# EAGLE design calculator (EAGLE 9.6.2)
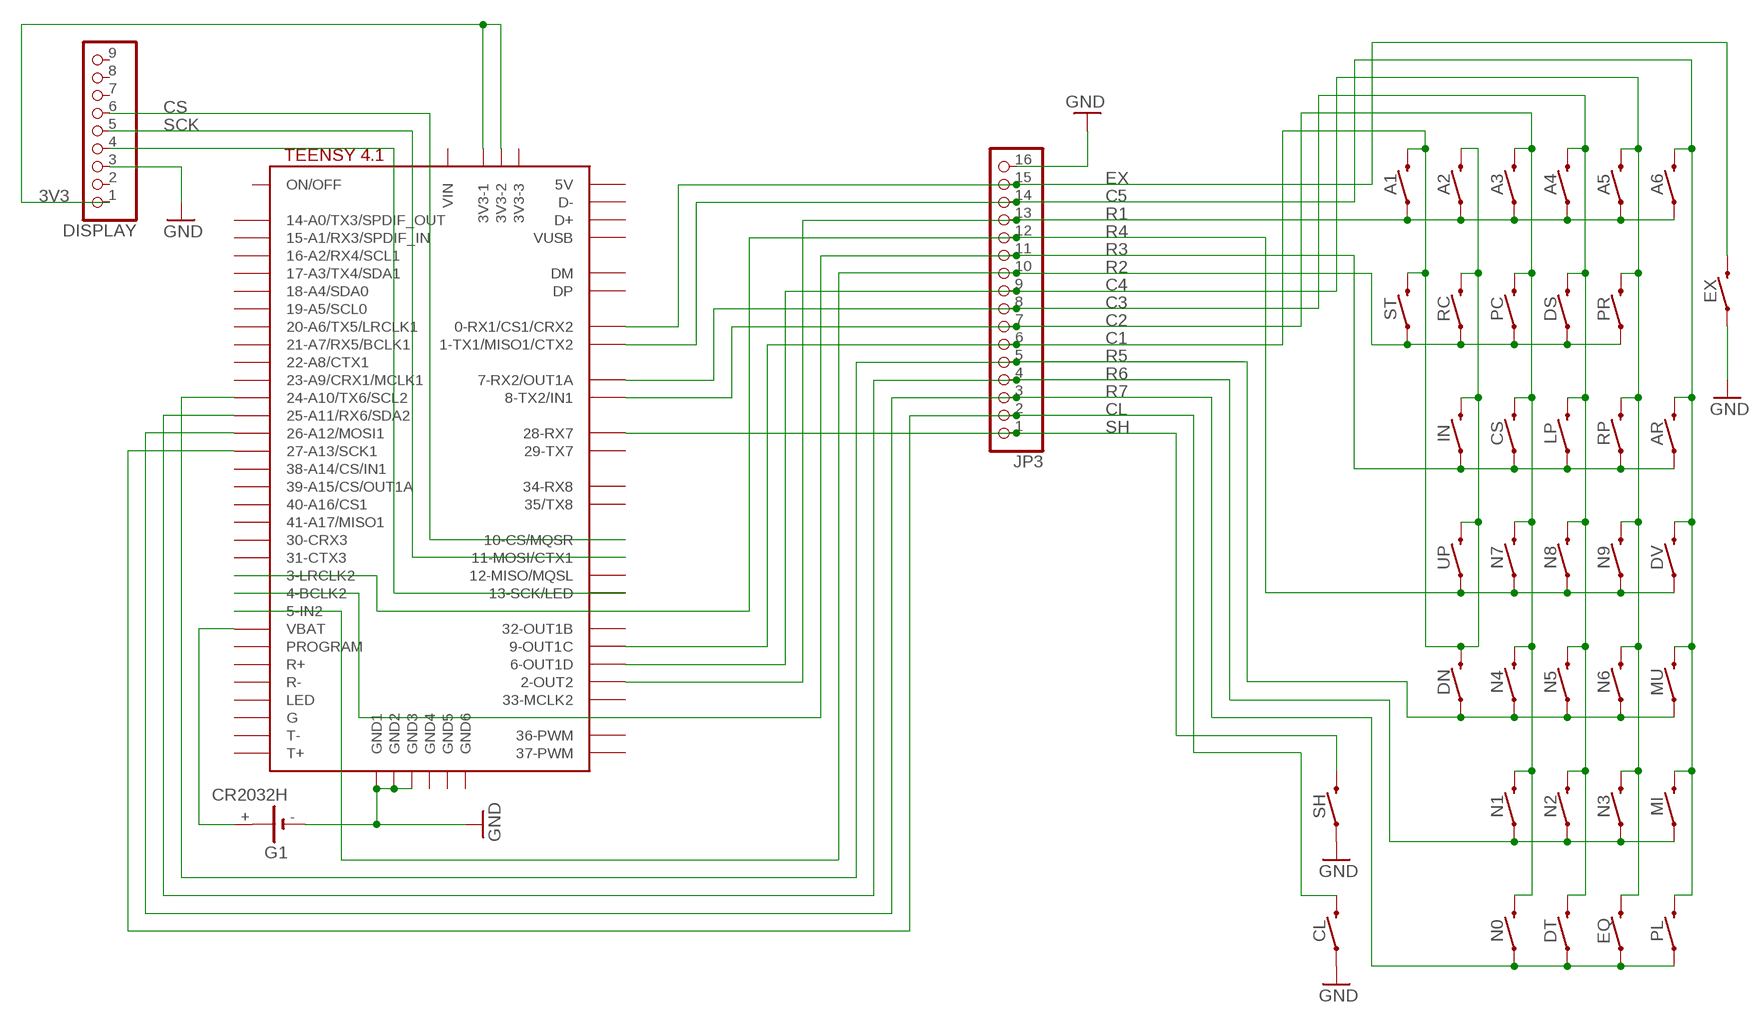
[diagram p0: schematic, sheet 1]

## Parts
A1  MOMENTARY-SWITCH-SPST-PTH-6.0MM  [TACTILE_SWITCH_PTH_6.0MM]
A2  MOMENTARY-SWITCH-SPST-PTH-6.0MM  [TACTILE_SWITCH_PTH_6.0MM]
A3  MOMENTARY-SWITCH-SPST-PTH-6.0MM  [TACTILE_SWITCH_PTH_6.0MM]
A4  MOMENTARY-SWITCH-SPST-PTH-6.0MM  [TACTILE_SWITCH_PTH_6.0MM]
A5  MOMENTARY-SWITCH-SPST-PTH-6.0MM  [TACTILE_SWITCH_PTH_6.0MM]
A6  MOMENTARY-SWITCH-SPST-PTH-6.0MM  [TACTILE_SWITCH_PTH_6.0MM]
AR  MOMENTARY-SWITCH-SPST-PTH-6.0MM  [TACTILE_SWITCH_PTH_6.0MM]
CL  MOMENTARY-SWITCH-SPST-PTH-6.0MM  [TACTILE_SWITCH_PTH_6.0MM]
CS  MOMENTARY-SWITCH-SPST-PTH-6.0MM  [TACTILE_SWITCH_PTH_6.0MM]
DISPLAY  PINHD-1X9  [1X09-BIG]
DN  MOMENTARY-SWITCH-SPST-PTH-6.0MM  [TACTILE_SWITCH_PTH_6.0MM]
DS  MOMENTARY-SWITCH-SPST-PTH-6.0MM  [TACTILE_SWITCH_PTH_6.0MM]
DT  MOMENTARY-SWITCH-SPST-PTH-6.0MM  [TACTILE_SWITCH_PTH_6.0MM]
DV  MOMENTARY-SWITCH-SPST-PTH-6.0MM  [TACTILE_SWITCH_PTH_6.0MM]
EQ  MOMENTARY-SWITCH-SPST-PTH-6.0MM  [TACTILE_SWITCH_PTH_6.0MM]
EX  MOMENTARY-SWITCH-SPST-PTH-6.0MM  [TACTILE_SWITCH_PTH_6.0MM]
G1  CR2032H  [CR2032H]
IN  MOMENTARY-SWITCH-SPST-PTH-6.0MM  [TACTILE_SWITCH_PTH_6.0MM]
JP3  PINHD-1X16  [1X16]
LP  MOMENTARY-SWITCH-SPST-PTH-6.0MM  [TACTILE_SWITCH_PTH_6.0MM]
MI  MOMENTARY-SWITCH-SPST-PTH-6.0MM  [TACTILE_SWITCH_PTH_6.0MM]
MU  MOMENTARY-SWITCH-SPST-PTH-6.0MM  [TACTILE_SWITCH_PTH_6.0MM]
N0  MOMENTARY-SWITCH-SPST-PTH-6.0MM  [TACTILE_SWITCH_PTH_6.0MM]
N1  MOMENTARY-SWITCH-SPST-PTH-6.0MM  [TACTILE_SWITCH_PTH_6.0MM]
N2  MOMENTARY-SWITCH-SPST-PTH-6.0MM  [TACTILE_SWITCH_PTH_6.0MM]
N3  MOMENTARY-SWITCH-SPST-PTH-6.0MM  [TACTILE_SWITCH_PTH_6.0MM]
N4  MOMENTARY-SWITCH-SPST-PTH-6.0MM  [TACTILE_SWITCH_PTH_6.0MM]
N5  MOMENTARY-SWITCH-SPST-PTH-6.0MM  [TACTILE_SWITCH_PTH_6.0MM]
N6  MOMENTARY-SWITCH-SPST-PTH-6.0MM  [TACTILE_SWITCH_PTH_6.0MM]
N7  MOMENTARY-SWITCH-SPST-PTH-6.0MM  [TACTILE_SWITCH_PTH_6.0MM]
N8  MOMENTARY-SWITCH-SPST-PTH-6.0MM  [TACTILE_SWITCH_PTH_6.0MM]
N9  MOMENTARY-SWITCH-SPST-PTH-6.0MM  [TACTILE_SWITCH_PTH_6.0MM]
PC  MOMENTARY-SWITCH-SPST-PTH-6.0MM  [TACTILE_SWITCH_PTH_6.0MM]
PL  MOMENTARY-SWITCH-SPST-PTH-6.0MM  [TACTILE_SWITCH_PTH_6.0MM]
PR  MOMENTARY-SWITCH-SPST-PTH-6.0MM  [TACTILE_SWITCH_PTH_6.0MM]
RC  MOMENTARY-SWITCH-SPST-PTH-6.0MM  [TACTILE_SWITCH_PTH_6.0MM]
RP  MOMENTARY-SWITCH-SPST-PTH-6.0MM  [TACTILE_SWITCH_PTH_6.0MM]
SH  MOMENTARY-SWITCH-SPST-PTH-6.0MM  [TACTILE_SWITCH_PTH_6.0MM]
ST  MOMENTARY-SWITCH-SPST-PTH-6.0MM  [TACTILE_SWITCH_PTH_6.0MM]
U$1  TEENSY41  [TEENSY41]
UP  MOMENTARY-SWITCH-SPST-PTH-6.0MM  [TACTILE_SWITCH_PTH_6.0MM]

## Nets
3V3: DISPLAY.1 U$1.3V3-1 U$1.3V3-2
C1: A1.3 A2.3 DN.3 IN.3 JP3.6 RC.3 ST.3 U$1.9-OUT1C UP.3
C2: A3.3 CS.3 JP3.7 N0.3 N1.3 N4.3 N7.3 PC.3 U$1.8-TX2/IN2(8-TX2/IN1)
C3: A4.3 DS.3 DT.3 JP3.8 LP.3 N2.3 N5.3 N8.3 U$1.7-RX2/OUT1A
C4: A5.3 EQ.3 JP3.9 N3.3 N6.3 N9.3 PR.3 RP.3 U$1.6-OUT1D
C5: A6.3 AR.3 DV.3 JP3.14 MI.3 MU.3 PL.3 U$1.1-TX1/MISO1/CTX2
CL: CL.3 JP3.2 U$1.27-A13/SCK1
CS: DISPLAY.6 U$1.10-CS\MQSR(10-CS/MQSR)
EX: EX.3 JP3.15 U$1.0-RX1/CS1/CRX2
GND: CL.1 DISPLAY.3 EX.1 G1.- JP3.16 SH.1 U$1.GND1 U$1.GND2 U$1.GND3
MOSI: DISPLAY.5 U$1.11-MOSI/CTX1
N$2: G1.+ U$1.VBAT
R1: A1.1 A2.1 A3.1 A4.1 A5.1 A6.1 JP3.13 U$1.2-OUT2
R2: DS.1 JP3.10 PC.1 PR.1 RC.1 ST.1 U$1.5-IN2
R3: AR.1 CS.1 IN.1 JP3.11 LP.1 RP.1 U$1.4-BCLK2
R4: DV.1 JP3.12 N7.1 N8.1 N9.1 U$1.3-LRCLK2 UP.1
R5: DN.1 JP3.5 MU.1 N4.1 N5.1 N6.1 U$1.24-A10/TX6/SCL2
R6: JP3.4 MI.1 N1.1 N2.1 N3.1 U$1.25-A11/RX6/SDA2
R7: DT.1 EQ.1 JP3.3 N0.1 PL.1 U$1.26-A12/MOSI1
SCK: DISPLAY.4 U$1.13-SCK/LED
SH: JP3.1 SH.3 U$1.28-RX7
Unconnected: DISPLAY.2 DISPLAY.7 DISPLAY.8 DISPLAY.9 G1.+@1(+) U$1.3V3-3 U$1.12-MISO/MQSL U$1.14-A0/TX3/SPDIF_OUT U$1.15-A1/RX3/SPDIF_IN U$1.16-A2/RX4/SCL1 U$1.17-A3/TX4/SDA1 U$1.18-A4/SDA0 U$1.19-A5/SCL0 U$1.20-A6/TX5/LRCLK1 U$1.21-A7/RX5/BCLK1 U$1.22-A8/CTX1 U$1.23-A9/CRX1/MCLK1 U$1.29-TX7 U$1.30-CRX3 U$1.31-CTX3 U$1.32-OUT1B U$1.33-MCLK2 U$1.34-RX8 U$1.35-TX8(35/TX8) U$1.36-PWM U$1.37-PWM U$1.38-A14/CS/IN1 U$1.39-A15/CS/OUT1A U$1.40-A16/CS1 U$1.41-A17/MISO1 U$1.+5V(5V) U$1.D+ U$1.D- U$1.DM U$1.DP U$1.G U$1.GND4 U$1.GND5 U$1.GND6 U$1.LED U$1.ON/OFF U$1.PROGRAM U$1.R+ U$1.R- U$1.T+ U$1.T- U$1.VIN U$1.VUSB

## Library data of the parts
A1-A6 AR CL CS DN DS DT DV EQ EX IN LP MI MU N0 N1-N9 PC PL PR RC RP SH ST UP = SparkFun-Switches:MOMENTARY-SWITCH-SPST: Momentary Switch (Pushbutton) - SPST Normally-open (NO) SPST momentary switches (buttons, pushbuttons). Variants PTH-12MM - 12mm square, through-hole Momentary Pushbutton Switch - 12mm Square <https://www.sparkfun.com/products/9190> (COM-09190) PTH-6.0MM, PTH-6.0MM-KIT - 6.0mm square, through-hole Mini Pushbutton Switch <https://www.sparkfun.com/products/97> (COM-00097) KIT package intended for soldering kit's - only one side of pads' copper is exposed. PTH-RIGHT-ANGLE-KIT - Right-angle, through-hole Right Angle Tactile Button <https://www.sparkfun.com/products/10791> - Used on SparkFun BigTime Watch Kit <https://www.sparkfun.com/products/11734> SMD-12MM - 12mm square, surface-mount Tactile Button - SMD (12mm) <https://www.sparkfun.com/products/12993> (COM-12993) Used on SparkFun PicoBoard <https://www.sparkfun.com/products/11888> SMD-4.5MM - 4.5mm Square Trackball Switch Used on SparkFun Blackberry Trackballer Breakout <https://www.sparkfun.com/products/13169> SMD-4.6MMX2.8MM - 4.60mm x 2.80mm, surface mount Used on SparkFun SAMD21 Mini Breakout <https://www.sparkfun.com/products/13664> SMD-5.2MM, SMD-5.2-REDUNDANT - 5.2mm square, surface-mount Mini Pushbutton Switch - SMD <https://www.sparkfun.com/products/8720> (COM-08720) Used on Arduino Pro Mini <https://www.sparkfun.com/products/11114> REDUNDANT package connects both switch circuits together SMD-6.0X3.5MM - 6.0 x 3.5mm, surface mount Momentary Reset Switch SMD <https://www.sparkfun.com/products/8229> (COM-08229) SMD-6.2MM-TALL - 6.2mm square, surface mount Tactile Button - SMD (6mm) <https://www.sparkfun.com/products/12992> Used on SparkFun Digital Sandbox <https://www.sparkfun.com/products/12651> SMD-RIGHT-ANGLE - Right-angle, surface mount Used on SparkFun Block for Intel® Edison - Arduino <https://www.sparkfun.com/products/13036>; PROD_ID: SWCH-08441; SF_SKU: COM-00097
DISPLAY = adafruit:PINHD-1X9: Pin header 1x10 0.1" spacing With round pins
G1 = battery:CR2032H: LI BATTERY Varta
JP3 = pinhead:PINHD-1X16: PIN HEADER
U$1 = teensy:TEENSY41

## Board
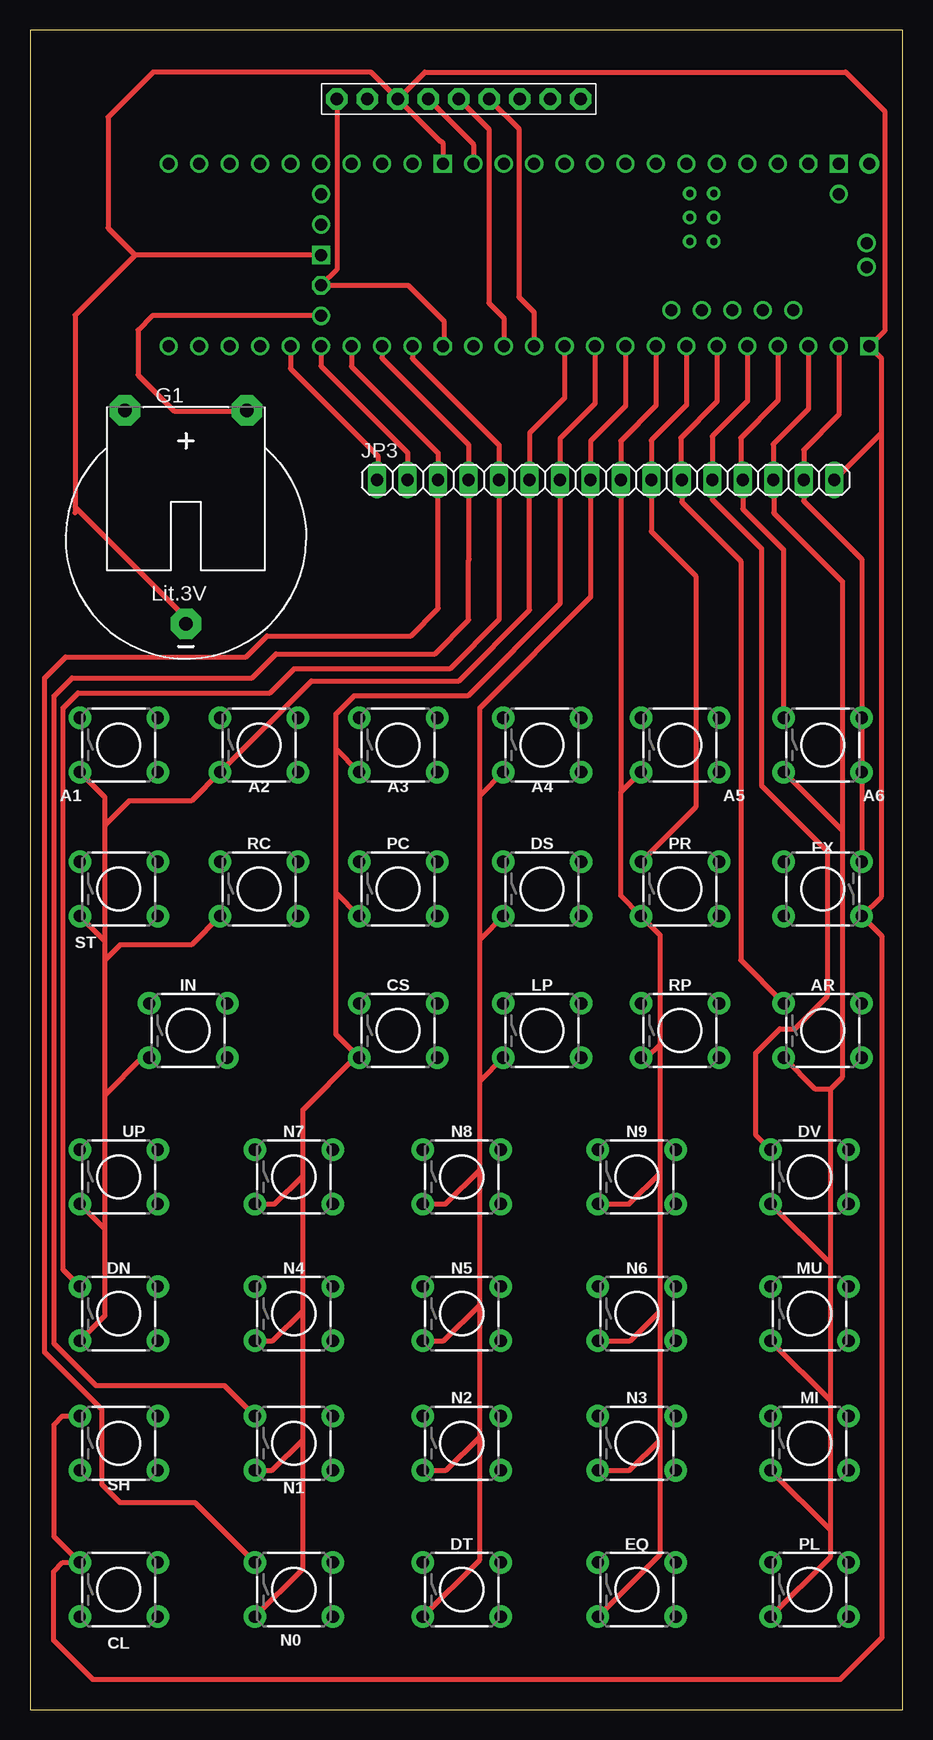
[diagram p1: board, top side]
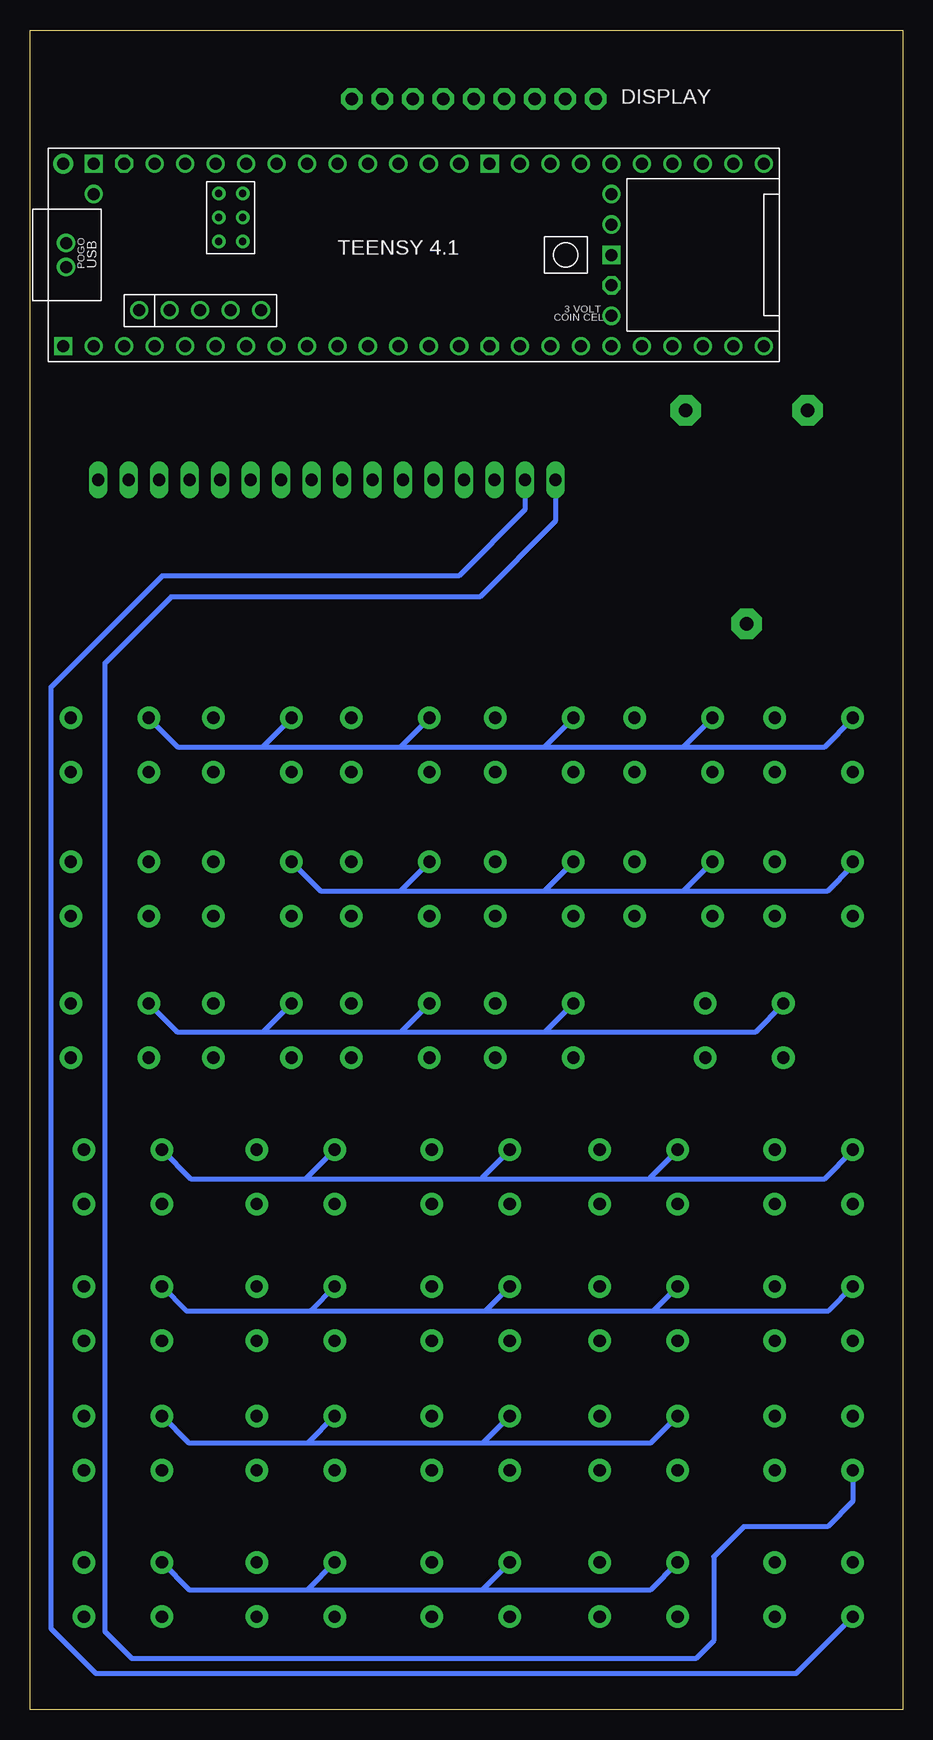
[diagram p2: board, bottom side, seen from below]

Size 72.75 x 140 mm. Coordinates in mm from the lower left corner, seen from the top.
Outline: 0,0 72.75,0 72.75,140 0,140 0,0
Copper layers (1*16): Top 0.035mm / dielectric 1.5mm / Bottom 0.035mm
Design rules "default": minimum track width 6mil, minimum drill 0.35mm, track to track 6mil, track to pad 6mil, pad to pad 6mil, via to via 6mil, smd to smd 6mil, copper to edge 40mil, drill to drill 6mil, minimum pad ring 10mil, minimum via ring 8mil, stop-mask expansion 4mil, vias tented up to drill 0mil, thermal gap 10mil

### Footprints (pad centres in the part's own frame; a part is rotated, then mirrored left to right if it is on the bottom)
TACTILE_SWITCH_PTH_6.0MM = drill 1.016 pad 1.88: 1 -3.251,2.261; 2 3.251,2.261; 3 -3.251,-2.261; 4 3.251,-2.261
1X09-BIG = drill 1.016 pad 1.778 octagon: 1 -10.16,0; 2 -7.62,0; 3 -5.08,0; 4 -2.54,0; 5 0,0; 6 2.54,0; 7 5.08,0; 8 7.62,0; 9 10.16,0
CR2032H = drill 1.118 pad 2.54 octagon: + 5.08,10.795; +@1 -5.08,10.795; - 0,-6.985
1X16 = drill 1.016 long: 1 -19.05,0; 2 -16.51,0; 3 -13.97,0; 4 -11.43,0; 5 -8.89,0; 6 -6.35,0; 7 -3.81,0; 8 -1.27,0; 9 1.27,0; 10 3.81,0; 11 6.35,0; 12 8.89,0; 13 11.43,0; 14 13.97,0; 15 16.51,0; 16 19.05,0
TEENSY41 = drill 1: 0-RX1/CS1/CRX2 -27.94,-7.62; 1-TX1/MISO1/CTX2 -25.4,-7.62; 2-OUT2 -22.86,-7.62; 3-LRCLK2 -20.32,-7.62; 4-BCLK2 -17.78,-7.62; 5-IN2 -15.24,-7.62; 6-OUT1D -12.7,-7.62; 7-RX2/OUT1A -10.16,-7.62; 8-TX2/IN2 -7.62,-7.62; 9-OUT1C -5.08,-7.62; 10-CS\MQSR -2.54,-7.62; 11-MOSI/CTX1 0,-7.62; 12-MISO/MQSL 2.54,-7.62; 13-SCK/LED 2.54,7.62; 14-A0/TX3/SPDIF_OUT 0,7.62; 15-A1/RX3/SPDIF_IN -2.54,7.62; 16-A2/RX4/SCL1 -5.08,7.62; 17-A3/TX4/SDA1 -7.62,7.62; 18-A4/SDA0 -10.16,7.62; 19-A5/SCL0 -12.7,7.62; 20-A6/TX5/LRCLK1 -15.24,7.62; 21-A7/RX5/BCLK1 -17.78,7.62; 22-A8/CTX1 -20.32,7.62; 23-A9/CRX1/MCLK1 -22.86,7.62; 24-A10/TX6/SCL2 7.62,-7.62; 25-A11/RX6/SDA2 10.16,-7.62; 26-A12/MOSI1 12.7,-7.62; 27-A13/SCK1 15.24,-7.62; 28-RX7 17.78,-7.62; 29-TX7 20.32,-7.62; 30-CRX3 22.86,-7.62; 31-CTX3 25.4,-7.62; 32-OUT1B 27.94,-7.62; 33-MCLK2 27.94,7.62; 34-RX8 25.4,7.62; 35-TX8 22.86,7.62; 36-PWM 20.32,7.62; 37-PWM 17.78,7.62; 38-A14/CS/IN1 15.24,7.62; 39-A15/CS/OUT1A 12.7,7.62; 40-A16/CS1 10.16,7.62; 41-A17/MISO1 7.62,7.62; +5V -24.13,-4.62; D+ -30.25,-1; D- -30.25,1; DM -21.59,-4.62; DP -19.05,-4.62; GND4 -16.51,-4.62; GND5 -13.97,-4.62; ON/OFF 15.24,5.08; PROGRAM 15.24,2.54; VBAT 15.24,-5.08; VUSB -27.94,5.08 | drill 1 octagon: 3V3-1 5.08,-7.62; 3V3-2 15.24,-2.54; 3V3-3 -25.4,7.62 | drill 0.6: G -15.51,3.12; LED -17.51,3.12; R+ -17.51,5.12; R- -15.51,5.12; T+ -15.51,1.12; T- -17.51,1.12 | drill 1 square: GND1 -30.48,-7.62; GND2 15.24,0; GND3 5.08,7.62; GND6 -27.94,7.62 | drill 1 pad 1.676: VIN -30.48,7.62

### Placement (x,y rotation side)
A1  7.4,80.4 0 top
A2  19.1,80.4 0 top
A3  30.7,80.4 0 top
A4  42.7,80.4 0 top
A5  54.2,80.4 0 top
A6  66.1,80.4 0 top
AR  66.1,56.6 0 top
CL  7.4,10 0 top
CS  30.7,56.6 0 top
DISPLAY  35.75,134.25 0 top
DN  7.4,33 0 top
DS  42.7,68.4 0 top
DT  36,10 0 top
DV  65,44.4 0 top
EQ  50.6,10 0 top
EX  66.1,68.4 180 top
G1  13,97.5 0 top
IN  13.19,56.6 0 top
JP3  48,102.5 0 top
LP  42.7,56.6 0 top
MI  65,22.2 0 top
MU  65,33 0 top
N0  22,10 0 top
N1  22,22.2 0 top
N2  36,22.2 0 top
N3  50.6,22.2 0 top
N4  22,33 0 top
N5  36,33 0 top
N6  50.6,33 0 top
N7  22,44.4 0 top
N8  36,44.4 0 top
N9  50.6,44.4 0 top
PC  30.7,68.4 0 top
PL  65,10 0 top
PR  54.2,68.4 0 top
RC  19.1,68.4 0 top
RP  54.2,56.6 0 top
SH  7.4,22.2 0 top
ST  7.4,68.4 0 top
U$1  39.5,121.25 0 bottom
UP  7.4,44.4 0 top

### Tracks (layer width: path | path; a pad name or v marks a point on that pad's centre or on a via)
3V3
  Top 0.406: DISPLAY.1 25.59,120.04 U$1.3V3-2 31.54,118.71 34.5,115.75 34.5,113.71 U$1.3V3-1
C1
  Top 0.406: DN.3 6.25,32.84 6.25,40.04 | A1.3 6.25,76.04 6.25,73.75 | 6.25,40.04 6.25,51.25 | 6.25,51.25 6.25,62.5 | 6.25,62.5 6.25,64.04 | 6.25,64.04 6.25,73.75 | UP.3 6.25,40.04 | ST.3 6.25,64.04 | 6.25,51.25 9.34,54.34 IN.3 | RC.3 13.46,63.75 7.5,63.75 6.25,62.5 | 6.25,73.75 8.25,75.75 13.46,75.75 A2.3 23.46,85.75 35.75,85.75 41.65,91.65 JP3.6 41.65,106.4 44.58,109.33 U$1.9-OUT1C
C2
  Top 0.406: N0.3 22.75,11.74 22.75,22.5 | 22.75,22.5 22.75,33.25 | 22.75,33.25 22.75,44.5 | 22.75,44.5 22.75,50 27.09,54.34 CS.3 25.5,56.29 25.5,68.09 | N1.3 20.19,19.94 22.75,22.5 | N4.3 20.24,30.74 22.75,33.25 | N7.3 20.39,42.14 22.75,44.5 | 25.5,68.09 25.5,80.09 | 25.5,80.09 25.5,83 27,84.5 36.5,84.5 44.19,92.19 JP3.7 44.19,105.94 47.12,108.87 U$1.8-TX2/IN2 | PC.3 25.5,68.09 | A3.3 25.5,80.09
C3
  Top 0.406: DT.3 37.5,12.49 37.5,22.75 | LP.3 37.5,52.39 | 37.5,22.75 37.5,33.75 | 37.5,33.75 37.5,45 | 37.5,45 37.5,52.39 | N2.3 34.69,19.94 37.5,22.75 | N5.3 34.49,30.74 37.5,33.75 | N8.3 34.64,42.14 37.5,45 | 37.5,52.39 37.5,64.19 | 37.5,64.19 37.5,76.19 | 37.5,76.19 37.5,83.5 46.73,92.73 JP3.8 46.73,105.73 49.66,108.66 U$1.7-RX2/OUT1A | DS.3 37.5,64.19 | A4.3 37.5,76.19
C4
  Top 0.406: EQ.3 52.56,12.95 52.56,22.5 | 52.56,22.5 52.56,33.25 | 52.56,33.25 52.56,44.75 | 52.56,44.75 52.56,55.5 | 52.56,55.5 52.56,64.53 PR.3 49.25,67.84 49.25,76.44 49.27,76.46 | N3.3 49.99,19.94 52.56,22.5 | N6.3 50.05,30.74 52.56,33.25 | N9.3 49.95,42.14 52.56,44.75 | RP.3 51.4,54.34 52.56,55.5 | A5.3 49.27,76.46 | 49.27,76.46 JP3.9 49.25,102.52 49.25,105.75 52.2,108.7 U$1.6-OUT1D
C5
  Top 0.406: PL.3 66.75,12.74 66.75,14.94 | 66.75,14.94 66.75,25.74 | 66.75,25.74 66.75,37.14 | 66.75,37.14 66.75,51.75 | 66.75,51.75 67.75,52.75 67.75,73.24 | 67.75,73.24 67.75,94 62,99.75 62,102.47 JP3.14 61.97,105.47 64.9,108.4 U$1.1-TX1/MISO1/CTX2 | A6.3 67.75,73.24 | AR.3 65.44,51.75 66.75,51.75 | DV.3 66.75,37.14 | MU.3 66.75,25.74 | MI.3 66.75,14.94
CL
  Top 0.406: U$1.27-A13/SCK1 24.26,111.99 31.49,104.76 JP3.2
  Bottom 0.406: CL.3 8.89,3 67.25,3 71,6.75 71,85.25 61.75,94.5 37,94.5 31.49,100.01 JP3.2
CS
  Top 0.406: DISPLAY.6 40.75,131.79 40.75,117.75 42.04,116.46 U$1.10-CS\MQSR
EX
  Top 0.406: JP3.15 64.51,101.75 | 64.51,101.75 64.51,100.74 69.35,95.9 EX.3 | U$1.0-RX1/CS1/CRX2 67.44,107.94 64.5,105 64.5,101.76 64.51,101.75
GND
  Top 0.406: SH.1 2.71,24.46 2,23.75 2,14.41 CL.1 2.73,12.26 1.97,11.5 1.97,5.78 5.25,2.5 67.53,2.5 71.03,6 71.03,64.46 EX.1 71,67.79 71,106.45 | 71,106.45 71,112.61 U$1.GND1 71.25,114.9 71.25,133.25 68,136.5 32.92,136.5 DISPLAY.3 | JP3.16 71,106.45 | DISPLAY.3 34.17,130.75 34.25,130.75 34.42,130.58 U$1.GND3 | U$1.GND2 8.75,121.25 | 8.75,121.25 3.75,116.25 3.75,100.25 | 3.75,100.25 3.75,99.77 | DISPLAY.3 28.42,136.5 10.25,136.5 6.5,132.75 6.5,123.5 8.75,121.25 | 3.75,100.25 13,91 G1.-
MOSI
  Top 0.406: U$1.11-MOSI/CTX1 39.5,116 38.25,117.25 38.25,131.75 DISPLAY.5
N$2
  Top 0.406: U$1.VBAT 10.17,116.17 9,115 9,111.25 12,108.25 18.04,108.25 G1.+
R1
  Top 0.406: A6.1 62.85,96.65 59.43,100.07 JP3.13 59.25,102.68 59.25,106 62.36,109.11 U$1.2-OUT2
  Bottom 0.406: A6.1 60.44,80.25 53.36,80.25 | 53.36,80.25 41.86,80.25 | 41.86,80.25 29.86,80.25 | 29.86,80.25 18.26,80.25 | 18.26,80.25 6.5,80.25 4.15,82.6 A1.1 | A2.1 18.26,80.25 | A3.1 29.86,80.25 | A4.1 41.86,80.25 | A5.1 53.36,80.25
R2
  Top 0.406: PR.1 55.5,75.21 55.5,94.5 51.81,98.19 JP3.10 51.81,105.81 54.74,108.74 U$1.5-IN2
  Bottom 0.406: PR.1 48.54,68.25 41.86,68.25 | 41.86,68.25 29.86,68.25 | 29.86,68.25 18.26,68.25 | 18.26,68.25 6.25,68.25 4.15,70.35 ST.1 | RC.1 18.26,68.25 | PC.1 29.86,68.25 | DS.1 41.86,68.25
R3
  Top 0.406: AR.1 59.25,62.46 59.25,95.75 54.35,100.65 JP3.11 54.25,102.6 54.25,106 57.28,109.03 U$1.4-BCLK2
  Bottom 0.406: AR.1 60.49,56.5 53.31,56.5 | 53.31,56.5 41.81,56.5 | 41.81,56.5 29.81,56.5 | 29.81,56.5 12.25,56.5 9.94,58.81 IN.1 | CS.1 29.81,56.5 | LP.1 41.81,56.5 | RP.1 53.31,56.5
R4
  Top 0.406: DV.1 60.5,47.91 60.5,54.75 62.5,56.75 63.75,56.75 66.5,59.5 66.5,71.5 61,77 61,96.75 56.89,100.86 56.89,102.25 JP3.12 56.89,106.14 59.82,109.07 U$1.3-LRCLK2
  Bottom 0.406: DV.1 59.34,44.25 49.75,44.25 | 49.75,44.25 35,44.25 | 35,44.25 21,44.25 | 21,44.25 6.5,44.25 4.15,46.6 UP.1 | N9.1 49.75,44.26 49.75,44.25 | N8.1 35,44.41 35,44.25 | N7.1 21,44.41 21,44.25
R5
  Top 0.406: DN.1 2.75,36.66 2.75,83.5 4,84.75 20,84.75 22,86.75 35,86.75 39.11,90.86 JP3.5 39.11,105.39 31.88,112.62 U$1.24-A10/TX6/SCL2
  Bottom 0.406: MU.1 59.74,33.25 49.36,33.25 | 20.76,33.25 N4.1 | 49.36,33.25 34.76,33.25 | 34.76,33.25 20.76,33.25 | 20.76,33.25 6.16,33.25 DN.1 | N5.1 34.76,33.25 | N6.1 49.36,33.25
R6
  Top 0.406: N1.1 16.21,27 5.5,27 2,30.5 2,84.5 3.5,86 18.5,86 20.5,88 33.75,88 36.57,90.82 36.57,95.82 | 36.61,95.86 36.57,95.82 | 36.57,95.82 JP3.4 36.57,105.43 29.34,112.66 U$1.25-A11/RX6/SDA2
  Bottom 0.406: MI.1 59.54,22.25 49.56,22.25 | N1.1 20.96,22.25 34.96,22.25 | 49.56,22.25 34.96,22.25 | N2.1 34.96,22.25 | N3.1 49.56,22.25
R7
  Top 0.406: N0.1 13.76,17.25 7.5,17.25 6,18.75 6,25 1.22,29.78 1.22,86 2.97,87.75 18,87.75 19.75,89.5 31.75,89.5 34.03,91.78 JP3.3 34.03,104.72 26.8,111.95 U$1.26-A12/MOSI1
  Bottom 0.406: PL.1 59.49,10 49.61,10 | 49.61,10 35.01,10 | 35.01,10 21,10 N0.1 | DT.1 35.01,10 | EQ.1 49.61,10
SCK
  Top 0.406: DISPLAY.4 36.96,130.5 U$1.13-SCK/LED
SH
  Top 0.406: U$1.28-RX7 21.72,111.78 29,104.5 29,102.55 JP3.1
  Bottom 0.406: SH.3 4.15,17.35 6.25,15.25 13.25,15.25 15.75,12.75 15.75,5.75 17.25,4.25 64.25,4.25 66.5,6.5 66.5,87.25 61,92.75 35.25,92.75 28.95,99.05 JP3.1